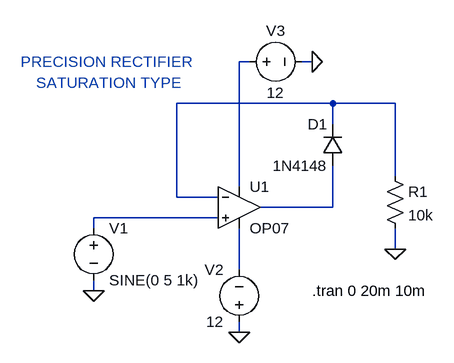
[diagram p0: schematic Saturation Type.asc]
Saturation Type.asc, the LTspice schematic file:
Version 4
SHEET 1 880 680
WIRE 192 -64 176 -64
WIRE 288 -64 272 -64
WIRE 320 0 80 0
WIRE 416 0 320 0
WIRE 320 32 320 0
WIRE 416 112 416 0
WIRE 176 128 176 -64
WIRE 80 144 80 0
WIRE 144 144 80 144
WIRE 320 160 320 96
WIRE 320 160 208 160
WIRE 144 176 -48 176
WIRE -48 192 -48 176
WIRE 416 224 416 192
WIRE 176 256 176 192
WIRE -48 288 -48 272
WIRE 176 352 176 336
FLAG 416 224 0
FLAG 176 352 0
FLAG 288 -64 0
FLAG -48 288 0
SYMBOL Opamps\\OP07 176 96 R0
SYMATTR InstName U1
SYMBOL diode 336 96 R180
WINDOW 0 24 64 Left 2
WINDOW 3 24 0 Left 2
SYMATTR InstName D1
SYMATTR Value 1N4148
SYMBOL res 400 96 R0
SYMATTR InstName R1
SYMATTR Value 10k
SYMBOL voltage -48 176 R0
WINDOW 123 0 0 Left 2
WINDOW 39 0 0 Left 2
SYMATTR InstName V1
SYMATTR Value SINE(0 5 1k)
SYMBOL voltage 176 352 R180
WINDOW 0 24 96 Left 2
WINDOW 3 24 16 Left 2
SYMATTR InstName V2
SYMATTR Value 12
SYMBOL voltage 176 -64 R270
WINDOW 0 32 56 VTop 2
WINDOW 3 -32 56 VBottom 2
SYMATTR InstName V3
SYMATTR Value 12
TEXT -136 -32 Left 2 ;SATURATION TYPE
TEXT -160 -64 Left 2 ;PRECISION RECTIFIER
TEXT 288 288 Left 2 !.tran 0 20m 10m

The netlist it stands for:
* Saturation Type.asc
XU1 N004 N002 N001 N005 N003 LT1001  ; OP07, pins In+ In- V+ V- OUT
D1 N003 N002 1N4148
R1 N002 0 10k
V1 N004 0 SINE(0 5 1k)
V2 0 N005 12
V3 N001 0 12
.model D D
.lib standard.dio
* SATURATION TYPE
* PRECISION RECTIFIER
.tran 0 20m 10m
.lib LTC.lib
.backanno
.end